# Altium schematic sheet source_A.SchDoc
size 381 x 241 mm; SheetNumber: 4; SheetTotal: 6
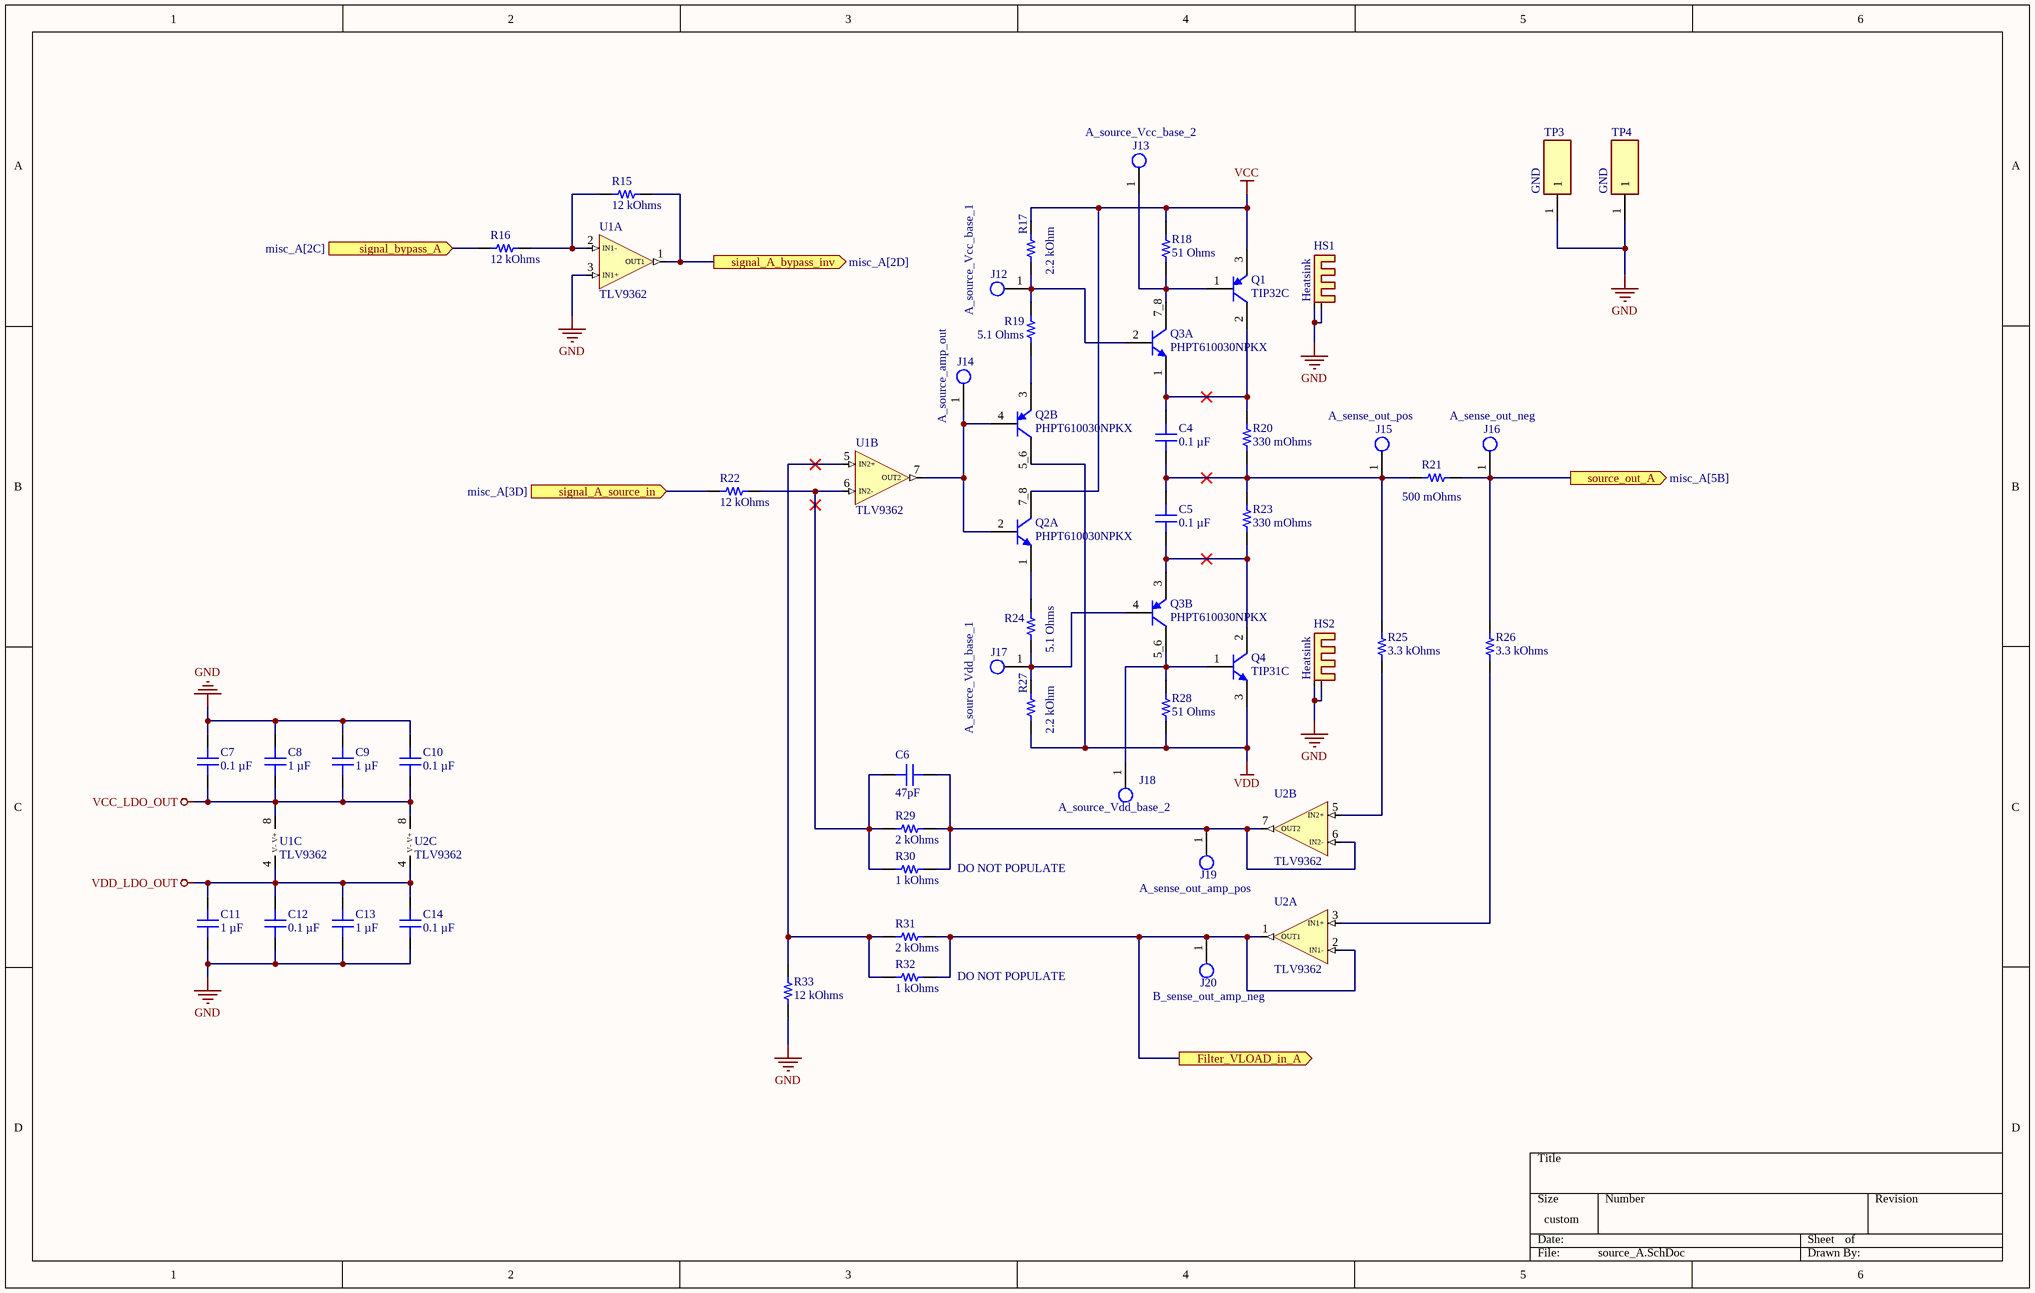
[diagram p0: source_A.SchDoc]

## Parts
C4  0.1 µF  [CAP 1206_3216 - 0.8MM]
C5  0.1 µF  [CAP 1206_3216 - 0.8MM]
C6  47pF  [CAP 1206_3216 - 1.8MM]
C7  0.1 µF  [CAP 1206_3216 - 0.8MM]
C8  1 µF  [CAP 1206_3216 - 0.8MM]
C9  1 µF  [CAP 1206_3216 - 0.8MM]
C10  0.1 µF  [CAP 1206_3216 - 0.8MM]
C11  1 µF  [CAP 1206_3216 - 0.8MM]
C12  0.1 µF  [CAP 1206_3216 - 0.8MM]
C13  1 µF  [CAP 1206_3216 - 0.8MM]
C14  0.1 µF  [CAP 1206_3216 - 0.8MM]
HS1  Heatsink  [593002B03400G]
HS2  Heatsink  [593002B03400G]
J12  A_source_Vcc_base_1  [FP-5001-MFG]
J13  A_source_Vcc_base_2  [FP-5001-MFG]
J14  A_source_amp_out  [FP-5001-MFG]
J15  A_sense_out_pos  [FP-5001-MFG]
J16  A_sense_out_neg  [FP-5001-MFG]
J17  A_source_Vdd_base_1  [FP-5001-MFG]
J18  A_source_Vdd_base_2  [FP-5001-MFG]
J19  A_sense_out_amp_pos  [FP-5001-MFG]
J20  B_sense_out_amp_neg  [FP-5001-MFG]
Q1  TIP32C  [ONSC-TO-220-3-221A-09]
Q2  PHPT610030NPKX  [TRANS_BUK9K18-40E,115]  (parts A,B of 2)
Q3  PHPT610030NPKX  [TRANS_BUK9K18-40E,115]  (parts A,B of 2)
Q4  TIP31C  [ONSC-TO-220-3-221A-09]
R15  12 kOhms  [RES 1206_3216]
R16  12 kOhms  [RES 1206_3216]
R17  2.2 kOhm  [RESC3116X65N]
R18  51 Ohms  [RES 1206_3216]
R19  5.1 Ohms  [RES 1206_3216]
R20  330 mOhms  [STACKPOLE CSR2512]
R21  500 mOhms  [STACKPOLE CSR2512]
R22  12 kOhms  [RES 1206_3216]
R23  330 mOhms  [STACKPOLE CSR2512]
R24  5.1 Ohms  [RES 1206_3216]
R25  3.3 kOhms  [YAGEO RES 1206_3216]
R26  3.3 kOhms  [YAGEO RES 1206_3216]
R27  2.2 kOhm  [RESC3116X65N]
R28  51 Ohms  [RES 1206_3216]
R29  2 kOhms  [RES 1206_3216]
R30  1 kOhms  [RES 1206_3216]
R31  2 kOhms  [RES 1206_3216]
R32  1 kOhms  [RES 1206_3216]
R33  12 kOhms  [RES 1206_3216]
TP3  GND  [S175146R]
TP4  GND  [S175146R]
U1  TLV9362  [SOIC8-127P600X175-8N]  (parts A,B,C of 3)
U2  TLV9362  [SOIC8-127P600X175-8N]  (parts A,B,C of 3)

## Ports
Filter_VLOAD_in_A (out), signal_A_bypass_inv (out, see misc_A[2D]), signal_A_source_in (in, see misc_A[3D]), signal_bypass_A (in, see misc_A[2C]), source_out_A (out, see misc_A[5B])

## Nets
GND: C7.1 C8.1 C9.2 C10.2 C11.2 C12.2 C13.2 C14.2 HS1.1 HS1.2 HS2.1 HS2.2 R33.1 TP3.1 TP4.1 U1.3(IN1+)
VCC: Q1.3(E) Q2.7_8(C1) R17.2 R18.2
VCC_LDO_OUT: C7.2 C8.2 C9.1 C10.1 U1.8(V+) U2.8(V+)
VDD: Q2.5_6(C2) Q4.3(E) R27.1 R28.1
VDD_LDO_OUT: C11.1 C12.1 C13.1 C14.1 U1.4(V-) U2.4(V-)
Filter_VLOAD_in_A: J20.1 R31.2 R32.2 U2.1(OUT1) U2.2(IN1-) ; port Filter_VLOAD_in_A
signal_A_bypass_inv: R15.2 U1.1(OUT1) ; port signal_A_bypass_inv
signal_A_source_in: R22.2 ; port signal_A_source_in
signal_bypass_A: R16.2 ; port signal_bypass_A
source_out_A: J16.1 R21.1 R26.1 ; port source_out_A
NetC4_1: C4.1 C5.2 J15.1 R20.1 R21.2 R23.2 R25.1
NetC4_2: C4.2 Q1.2(C) Q3.1(E1) R20.2
NetC5_1: C5.1 Q3.3(E2) Q4.2(C) R23.1
NetC6_1: C6.1 R22.1 R29.1 R30.1 U1.6(IN2-)
NetC6_2: C6.2 J19.1 R29.2 R30.2 U2.6(IN2-) U2.7(OUT2)
NetJ12_1: J12.1 Q3.2(B1) R17.1 R19.2
NetJ13_1: J13.1 Q1.1(B) Q3.7_8(C1) R18.1
NetJ14_1: J14.1 Q2.2(B1) Q2.4(B2) U1.7(OUT2)
NetJ17_1: J17.1 Q3.4(B2) R24.1 R27.2
NetJ18_1: J18.1 Q3.5_6(C2) Q4.1(B) R28.2
NetQ2_1: Q2.1(E1) R24.2
NetQ2_3: Q2.3(E2) R19.1
NetR15_1: R15.1 R16.1 U1.2(IN1-)
NetR25_2: R25.2 U2.5(IN2+)
NetR26_2: R26.2 U2.3(IN1+)
NetR31_1: R31.1 R32.1 R33.2 U1.5(IN2+)

## Notes on the sheet
- DO NOT POPULATE

## Library data of the parts
C4 C5 C7 C10 C12 C14 = 885012208087: CAP CER 0.1UF 50V X7R 1206; manufacturer: Würth Elektronik; Tolerance: ±10%; Part Number: 885012208087; Capacitance: 0.1 µF; Applications: General Purpose; componentlink1description: Datasheet; componentlink1url: https://katalog.we-online.de/pbs/datasheet/885012208087.pdf; componentlink2description: DigiKey Link; componentlink2url: https://www.digikey.com/en/products/detail/würth-elektronik/885012208087/5453982; Device Package: 1206 (3216 Metric); lastupdated: 6/4/2024 19:10:27; Lifecycle Status: Active; Minimum Order: 1; Mounting Type: Surface Mount, MLCC; Operating Temperature: -55°C ~ 125°C; Package / Case: 1206 (3216 Metric); packaging: TapeAndReel; partid: 20879; Part Status: Active; price: 0.06; series: WCAP-CSGP; Size / Dimension: 0.126" L x 0.063" W (3.20mm x 1.60mm); Supplier 1: DigiKey; Supplier Part Number 1: 732-8127-1-ND; Temperature Coefficient: X7R; Thickness (Max): 0.035" (0.90mm); value: 0.1 µF; Voltage - Rated: 50V
C6 = 1206AA470KAT1A: CAP CER 47PF 1KV C0G/NP0 1206; manufacturer: AVX Corporation; Temperature Coefficient: C0G, NP0; Tolerance: ±10%; Voltage - Rated: 1000V (1kV); Part Number: 1206AA470KAT1A; Capacitance: 47pF; Applications: General Purpose; componentlink1description: Datasheet; componentlink1url: http://datasheets.avx.com/AVX-HV_MLCC.pdf; componentlink2description: DigiKey Link; componentlink2url: http://digikey.com/product-detail/en/avx-corporation/1206AA470KAT1A/478-2949-1-ND/808148; Device Package: 1206 (3216 Metric); Features: High Voltage; lastupdated: 9/2/2020 01:05:31; Lifecycle Status: Active; Minimum Order: 1; Mounting Type: Surface Mount, MLCC; Operating Temperature: -55°C ~ 125°C; Package / Case: 1206 (3216 Metric); packaging: TapeAndReel; partid: 21825; Part Status: Active; price: 0.11; series: -; Size / Dimension: 0.130" L x 0.063" W (3.30mm x 1.60mm); Supplier 1: DigiKey; Supplier Part Number 1: 478-2949-1-ND; Thickness (Max): 0.071" (1.80mm); value: 47pF
C8 C9 C11 C13 = 885012208093: CAP CER 1UF 50V X7R 1206; manufacturer: Würth Elektronik; Tolerance: ±10%; Part Number: 885012208093; Capacitance: 1 µF; Applications: General Purpose; componentlink1description: Datasheet; componentlink1url: https://katalog.we-online.de/pbs/datasheet/885012208093.pdf; componentlink2description: DigiKey Link; componentlink2url: https://www.digikey.com/en/products/detail/würth-elektronik/885012208093/5453432; Device Package: 1206 (3216 Metric); lastupdated: 6/4/2024 19:10:33; Lifecycle Status: Active; Minimum Order: 1; Mounting Type: Surface Mount, MLCC; Operating Temperature: -55°C ~ 125°C; Package / Case: 1206 (3216 Metric); packaging: TapeAndReel; partid: 39665; Part Status: Active; price: 0.10; series: WCAP-CSGP; Size / Dimension: 0.126" L x 0.063" W (3.20mm x 1.60mm); Supplier 1: DigiKey; Supplier Part Number 1: 732-7577-1-ND; Temperature Coefficient: X7R; Thickness (Max): 0.075" (1.90mm); value: 1 µF; Voltage - Rated: 50V
HS1 HS2 = 593002B03400G: 593002B03400G Heatsink TO220 13.4 C/W; Manufacturer_Name: Aavid Thermalloy; Datasheet Link: 3dofAavidThermalloy593002B03400G; Height: 29.97mm; Manufacturer_Part_Number: 593002B03400G; Mouser Part Number: 532-593002B03400G; Mouser Price/Stock: https://www.mouser.co.uk/ProductDetail/Aavid/593002B03400G?qs=W5RTpZXIxnNcIJ9LzCiOiQ%3D%3D; Arrow Part Number: 593002B03400G; Arrow Price/Stock: https://www.arrow.com/en/products/593002b03400g/aavid-thermalloy
J12-J20 = 5001: PC TEST POINT MINIATURE BLACK; Body Material: Bronze; Plating: Silver; Inside Diameter: 1.27mm; Hole Diameter: 1.6mm; Number of Ports: 1; Outside Diameter: 2.54mm; Insulation: Insulated; Insulation Material: Nylon; Mount: Through Hole; RoHS Compliant: Yes; Series: THM; Height: 0.3inch; Termination: Through Hole; Material: Nylon; Packaging: Bulk; Contact Material: Bronze; REACH SVHC: No SVHC; Contact Plating: Silver; Orientation: Straight; Lead Free: Lead Free; Package Quantity: 100; Length: 7.62mm; Flammability Rating: UL94 V-0; Number of Contacts: 1; Diameter: 2.54mm; Housing Color: Black; Color: Black; Supplier 1: Mouser; Supplier Part Number 1: 534-5001
Q1 = TIP32C: Complementary Silicon Plastic Power Transistor, 3-Pin TO-220, Tube; Manufacturer: On Semiconductor; fT Min (MHz): 3; Polarity: PNP; DatasheetVersion: Rev. 14; PackageVersion: Rev. AG, 09/2011; PackageReference: TO-220-3-221A-09; PackageDescription: 3-Pin Flange Mount, Vertical Straight Lead, Body 9.97 x 4.445 mm, Pitch 2.54 mm; Supplier 1: Digi-Key; Supplier Part Number 1: TIP32COS-ND; IC Continuous (A): 3; Packing: Tube; RoHS: FALSE; Mounting Technology: Through Hole; PartNumber: TIP32C; ComponentLink1Description: Manufacturer URL; ComponentLink1URL: http://www.onsemi.com/; ComponentLink2Description: Datasheet; ComponentLink2URL: http://www.onsemi.com/pub_link/Collateral/TIP31A-D.PDF; ComponentLink3Description: Package Specification; ComponentLink3URL: http://www.onsemi.com/pub_link/Collateral/221A-09.PDF
Q2 Q3 = PHPT610030NPK: ComponentLink1Description: Datasheet; ComponentLink1URL: https://assets.nexperia.com/documents/data-sheet/PHPT610030NPK.pdf; ComponentLink2Description: Supplier; ComponentLink2URL: https://hr.mouser.com/ProductDetail/Nexperia/PHPT610030NPKX?qs=%252BRKXB2WKlSeoXKhT5DAScw%3D%3D
Q4 = TIP31C: Complementary Silicon Plastic Power Transistor, 3-Pin TO-220, Tube; Manufacturer: On Semiconductor; fT Min (MHz): 3; Polarity: NPN; DatasheetVersion: Rev. 14; PackageVersion: Rev. AG, 09/2011; PackageReference: TO-220-3-221A-09; PackageDescription: 3-Pin Flange Mount, Vertical Straight Lead, Body 9.97 x 4.445 mm, Pitch 2.54 mm; Supplier 1: Digi-Key; Supplier Part Number 1: TIP31COS-ND; IC Continuous (A): 3; Packing: Tube; RoHS: FALSE; Mounting Technology: Through Hole; PartNumber: TIP31C; ComponentLink1Description: Manufacturer URL; ComponentLink1URL: http://www.onsemi.com/; ComponentLink2Description: Datasheet; ComponentLink2URL: http://www.onsemi.com/pub_link/Collateral/TIP31A-D.PDF; ComponentLink3Description: Package Specification; ComponentLink3URL: http://www.onsemi.com/pub_link/Collateral/221A-09.PDF
R15 R16 R22 R33 = ERA-8AEB123V: RES SMD 12K OHM 0.1% 1/4W 1206; Manufacturer: Panasonic Electronic Components; Power (Watts): 0.25W, 1/4W; Temperature Coefficient: ±25ppm/°C; Part Number: ERA-8AEB123V; ComponentLink1Description: Datasheet; ComponentLink1URL: https://industrial.panasonic.com/cdbs/www-data/pdf/RDM0000/AOA0000C307.pdf; ComponentLink2Description: DigiKey Link; ComponentLink2URL: https://www.digikey.com/en/products/detail/panasonic-electronic-components/ERA-8AEB123V/3070775; Composition: Thin Film; Device Package: 1206 (3216 Metric); Height - Seated (Max): 0.028" (0.70mm); LastUpdated: 2/9/2024 20:53:53; Lifecycle Status: Active; Minimum Order: 1; Number of Terminations: 2; Operating Temperature: -55°C ~ 155°C; Package / Case: 1206 (3216 Metric); Packaging: TapeAndReel; PartId: 40988; Part Status: Active; Price: 0.10; Resistance: 12 kOhms; Series: ERA-8A; Size / Dimension: 0.126" L x 0.063" W (3.20mm x 1.60mm); Supplier 1: DigiKey; Supplier Part Number 1: 10-ERA-8AEB123VCT-ND; Supplier Device Package: 1206; Tolerance: ±0.1%; Value: 12 kOhms; Features: Automotive AEC-Q200; Ratings: AEC-Q200
R17 R27 = RT1206FRE072K2L: Resistor; Manufacturer_Name: YAGEO; Datasheet Link: https://www.mouser.com/datasheet/2/447/PYu_RT_1_to_0_01_RoHS_L_12-3003070.pdf; Height: 0.65mm; Manufacturer_Part_Number: RT1206FRE072K2L; Mouser Part Number: 603-RT1206FRE072K2L; Mouser Price/Stock: https://www.mouser.co.uk/ProductDetail/YAGEO/RT1206FRE072K2L?qs=yNCrj0CQcyJif6VASMbdeQ%3D%3D; Arrow Part Number: RT1206FRE072K2L; Arrow Price/Stock: https://www.arrow.com/en/products/rt1206fre072k2l/yageo?utm_currency=USD&region=nac
R18 R28 = ERJ-8GEYJ510V: RES SMD 51 OHM 5% 1/4W 1206; Manufacturer: Panasonic Electronic Components; Power (Watts): 0.25W, 1/4W; Temperature Coefficient: ±200ppm/°C; Part Number: ERJ-8GEYJ510V; ComponentLink1Description: Datasheet; ComponentLink1URL: http://industrial.panasonic.com/www-cgi/jvcr13pz.cgi?E+PZ+3+AOA0001+ERJ8GEYJ510V+7+WW; ComponentLink2Description: DigiKey Link; ComponentLink2URL: https://www.digikey.com/en/products/detail/panasonic-electronic-components/ERJ-8GEYJ510V/11678; Composition: Thick Film; Device Package: 1206 (3216 Metric); Features: Automotive AEC-Q200; Height - Seated (Max): 0.028" (0.70mm); LastUpdated: 2/9/2024 20:54:16; Lifecycle Status: Active; Minimum Order: 1; Number of Terminations: 2; Operating Temperature: -55°C ~ 155°C; Package / Case: 1206 (3216 Metric); Packaging: TapeAndReel; PartId: 34147; Part Status: Active; Price: 0.02; Ratings: AEC-Q200; Resistance: 51 Ohms; Series: ERJ-8G; Size / Dimension: 0.126" L x 0.063" W (3.20mm x 1.60mm); Supplier 1: DigiKey; Supplier Part Number 1: P51ECT-ND; Supplier Device Package: 1206; Tolerance: ±5%; Value: 51 Ohms
R19 R24 = ERJ-8GEYJ5R1V: RES SMD 5.1 OHM 5% 1/4W 1206; Manufacturer: Panasonic Electronic Components; Power (Watts): 0.25W, 1/4W; Temperature Coefficient: -100/ +600ppm/°C; Part Number: ERJ-8GEYJ5R1V; ComponentLink1Description: Datasheet; ComponentLink1URL: http://industrial.panasonic.com/www-cgi/jvcr13pz.cgi?E+PZ+3+AOA0001+ERJ8GEYJ5R1V+7+WW; ComponentLink2Description: DigiKey Link; ComponentLink2URL: https://www.digikey.com/en/products/detail/panasonic-electronic-components/ERJ-8GEYJ5R1V/282211; Composition: Thick Film; Device Package: 1206 (3216 Metric); Features: Automotive AEC-Q200; Height - Seated (Max): 0.028" (0.70mm); LastUpdated: 2/9/2024 20:54:09; Lifecycle Status: Active; Minimum Order: 1; Number of Terminations: 2; Operating Temperature: -55°C ~ 155°C; Package / Case: 1206 (3216 Metric); Packaging: TapeAndReel; PartId: 36042; Part Status: Active; Price: 0.02; Ratings: AEC-Q200; Resistance: 5.1 Ohms; Series: ERJ-8G; Size / Dimension: 0.126" L x 0.063" W (3.20mm x 1.60mm); Supplier 1: DigiKey; Supplier Part Number 1: P5.1ECT-ND; Supplier Device Package: 1206; Tolerance: ±5%; Value: 5.1 Ohms
R20 R23 = CSRN2512FKR330: RES 0.33 OHM 1% 2W 2512; Manufacturer: Stackpole Electronics Inc; Temperature Coefficient: ±200ppm/°C; Part Number: CSRN2512FKR330; Package / Case: 2512 (6432 Metric); ComponentLink1Description: Datasheet; ComponentLink1URL: https://www.seielect.com/catalog/sei-csr_csrn.pdf; ComponentLink2Description: DigiKey Link; ComponentLink2URL: https://www.digikey.com/en/products/detail/stackpole-electronics-inc/CSRN2512FKR330/1742756; Composition: Thick Film; Device Package: 2512 (6432 Metric); Features: Current Sense; Height - Seated (Max): 0.028" (0.70mm); LastUpdated: 2/17/2022 18:43:57; Lifecycle Status: Active; Minimum Order: 1; Number of Terminations: 2; Operating Temperature: -55°C ~ 155°C; Packaging: TapeAndReel; PartId: 1770; Part Status: Active; Power (Watts): 2W; Price: 0.12; Resistance: 330 mOhms; Series: CSRN; Size / Dimension: 0.250" L x 0.124" W (6.35mm x 3.15mm); Supplier 1: DigiKey; Supplier Part Number 1: CSRN2512FKR330CT-ND; Supplier Device Package: 2512; Tolerance: ±1%; Value: 330 mOhms
R21 = CSRN2512FKR500: RES 0.5 OHM 1% 2W 2512; Manufacturer: Stackpole Electronics Inc; Temperature Coefficient: ±200ppm/°C; Part Number: CSRN2512FKR500; Package / Case: 2512 (6432 Metric); ComponentLink1Description: Datasheet; ComponentLink1URL: https://www.seielect.com/catalog/sei-csr_csrn.pdf; ComponentLink2Description: DigiKey Link; ComponentLink2URL: https://www.digikey.com/en/products/detail/stackpole-electronics-inc/CSRN2512FKR500/1742768; Composition: Thick Film; Device Package: 2512 (6432 Metric); Features: Current Sense; Height - Seated (Max): 0.028" (0.70mm); LastUpdated: 2/17/2022 18:43:58; Lifecycle Status: Active; Minimum Order: 1; Number of Terminations: 2; Operating Temperature: -55°C ~ 155°C; Packaging: TapeAndReel; PartId: 1683; Part Status: Active; Power (Watts): 2W; Price: 0.07; Resistance: 500 mOhms; Series: CSRN; Size / Dimension: 0.250" L x 0.124" W (6.35mm x 3.15mm); Supplier 1: DigiKey; Supplier Part Number 1: CSRN2512FKR500CT-ND; Supplier Device Package: 2512; Tolerance: ±1%; Value: 500 mOhms
R25 R26 = RT1206FRE073K3L: RES SMD 3.3K OHM 1% 1/4W 1206; Manufacturer: Yageo; Power (Watts): 0.25W, 1/4W; Temperature Coefficient: ±50ppm/°C; Part Number: RT1206FRE073K3L; ComponentLink1Description: Datasheet; ComponentLink1URL: https://www.yageo.com/upload/media/product/productsearch/datasheet/rchip/PYu-RT_1-to-0.01_RoHS_L_12.pdf; ComponentLink2Description: DigiKey Link; ComponentLink2URL: https://www.digikey.com/en/products/detail/yageo/RT1206FRE073K3L/1083187; Composition: Thin Film; Device Package: 1206 (3216 Metric); Height - Seated (Max): 0.026" (0.65mm); LastUpdated: 7/25/2024 09:21:22; Lifecycle Status: Active; Minimum Order: 1; Number of Terminations: 2; Operating Temperature: -55°C ~ 155°C; Package / Case: 1206 (3216 Metric); Packaging: TapeAndReel; PartId: 58380; Part Status: Active; Price: 0.01; Resistance: 3.3 kOhms; Series: RT; Size / Dimension: 0.122" L x 0.063" W (3.10mm x 1.60mm); Supplier 1: DigiKey; Supplier Part Number 1: 13-RT1206FRE073K3LCT-ND; Supplier Device Package: 1206; Tolerance: ±1%; Value: 3.3 kOhms
R29 R31 = ERA-8AEB202V: RES SMD 2K OHM 0.1% 1/4W 1206; Manufacturer: Panasonic Electronic Components; Power (Watts): 0.25W, 1/4W; Temperature Coefficient: ±25ppm/°C; Part Number: ERA-8AEB202V; ComponentLink1Description: Datasheet; ComponentLink1URL: https://industrial.panasonic.com/cdbs/www-data/pdf/RDM0000/AOA0000C307.pdf; ComponentLink2Description: DigiKey Link; ComponentLink2URL: https://www.digikey.com/en/products/detail/panasonic-electronic-components/ERA-8AEB202V/3070866; Composition: Thin Film; Device Package: 1206 (3216 Metric); Features: Automotive AEC-Q200; Height - Seated (Max): 0.028" (0.70mm); LastUpdated: 2/9/2024 20:54:17; Lifecycle Status: Active; Minimum Order: 1; Number of Terminations: 2; Operating Temperature: -55°C ~ 155°C; Package / Case: 1206 (3216 Metric); Packaging: TapeAndReel; PartId: 34011; Part Status: Active; Price: 0.10; Ratings: AEC-Q200; Resistance: 2 kOhms; Series: ERA-8A; Size / Dimension: 0.126" L x 0.063" W (3.20mm x 1.60mm); Supplier 1: DigiKey; Supplier Part Number 1: P2.0KBCCT-ND; Supplier Device Package: 1206; Tolerance: ±0.1%; Value: 2 kOhms
R30 R32 = ERA-8AEB102V: RES SMD 1K OHM 0.1% 1/4W 1206; Manufacturer: Panasonic Electronic Components; Power (Watts): 0.25W, 1/4W; Temperature Coefficient: ±25ppm/°C; Part Number: ERA-8AEB102V; ComponentLink1Description: Datasheet; ComponentLink1URL: https://industrial.panasonic.com/cdbs/www-data/pdf/RDM0000/AOA0000C307.pdf; ComponentLink2Description: DigiKey Link; ComponentLink2URL: https://www.digikey.com/en/products/detail/panasonic-electronic-components/ERA-8AEB102V/3070741; Composition: Thin Film; Device Package: 1206 (3216 Metric); Features: Automotive AEC-Q200; Height - Seated (Max): 0.028" (0.70mm); LastUpdated: 2/9/2024 20:54:17; Lifecycle Status: Active; Minimum Order: 1; Number of Terminations: 2; Operating Temperature: -55°C ~ 155°C; Package / Case: 1206 (3216 Metric); Packaging: TapeAndReel; PartId: 33986; Part Status: Active; Price: 0.10; Ratings: AEC-Q200; Resistance: 1 kOhms; Series: ERA-8A; Size / Dimension: 0.126" L x 0.063" W (3.20mm x 1.60mm); Supplier 1: DigiKey; Supplier Part Number 1: P1.0KBCCT-ND; Supplier Device Package: 1206; Tolerance: ±0.1%; Value: 1 kOhms
TP3 TP4 = S1751-46R: Test Point; Manufacturer_Name: Harwin; Datasheet Link: https://cdn.harwin.com/pdfs/S1751R.pdf; Height: 2mm; Manufacturer_Part_Number: S1751-46R; Mouser Part Number: 855-S1751-46R; Mouser Price/Stock: https://www.mouser.co.uk/ProductDetail/Harwin/S1751-46R?qs=l6ZPVqNVZb71wETAKrfRig%3D%3D
U1 U2 = TLV9362: TLV936x 10-MHz, 40-V, RRO, Operational Amplifie; ComponentLink1Description: Datasheet; ComponentLink1URL: https://www.ti.com/lit/ds/symlink/tlv9362.pdf